# EAGLE design stlink_v3_CAN_shield (EAGLE 9.5.2)
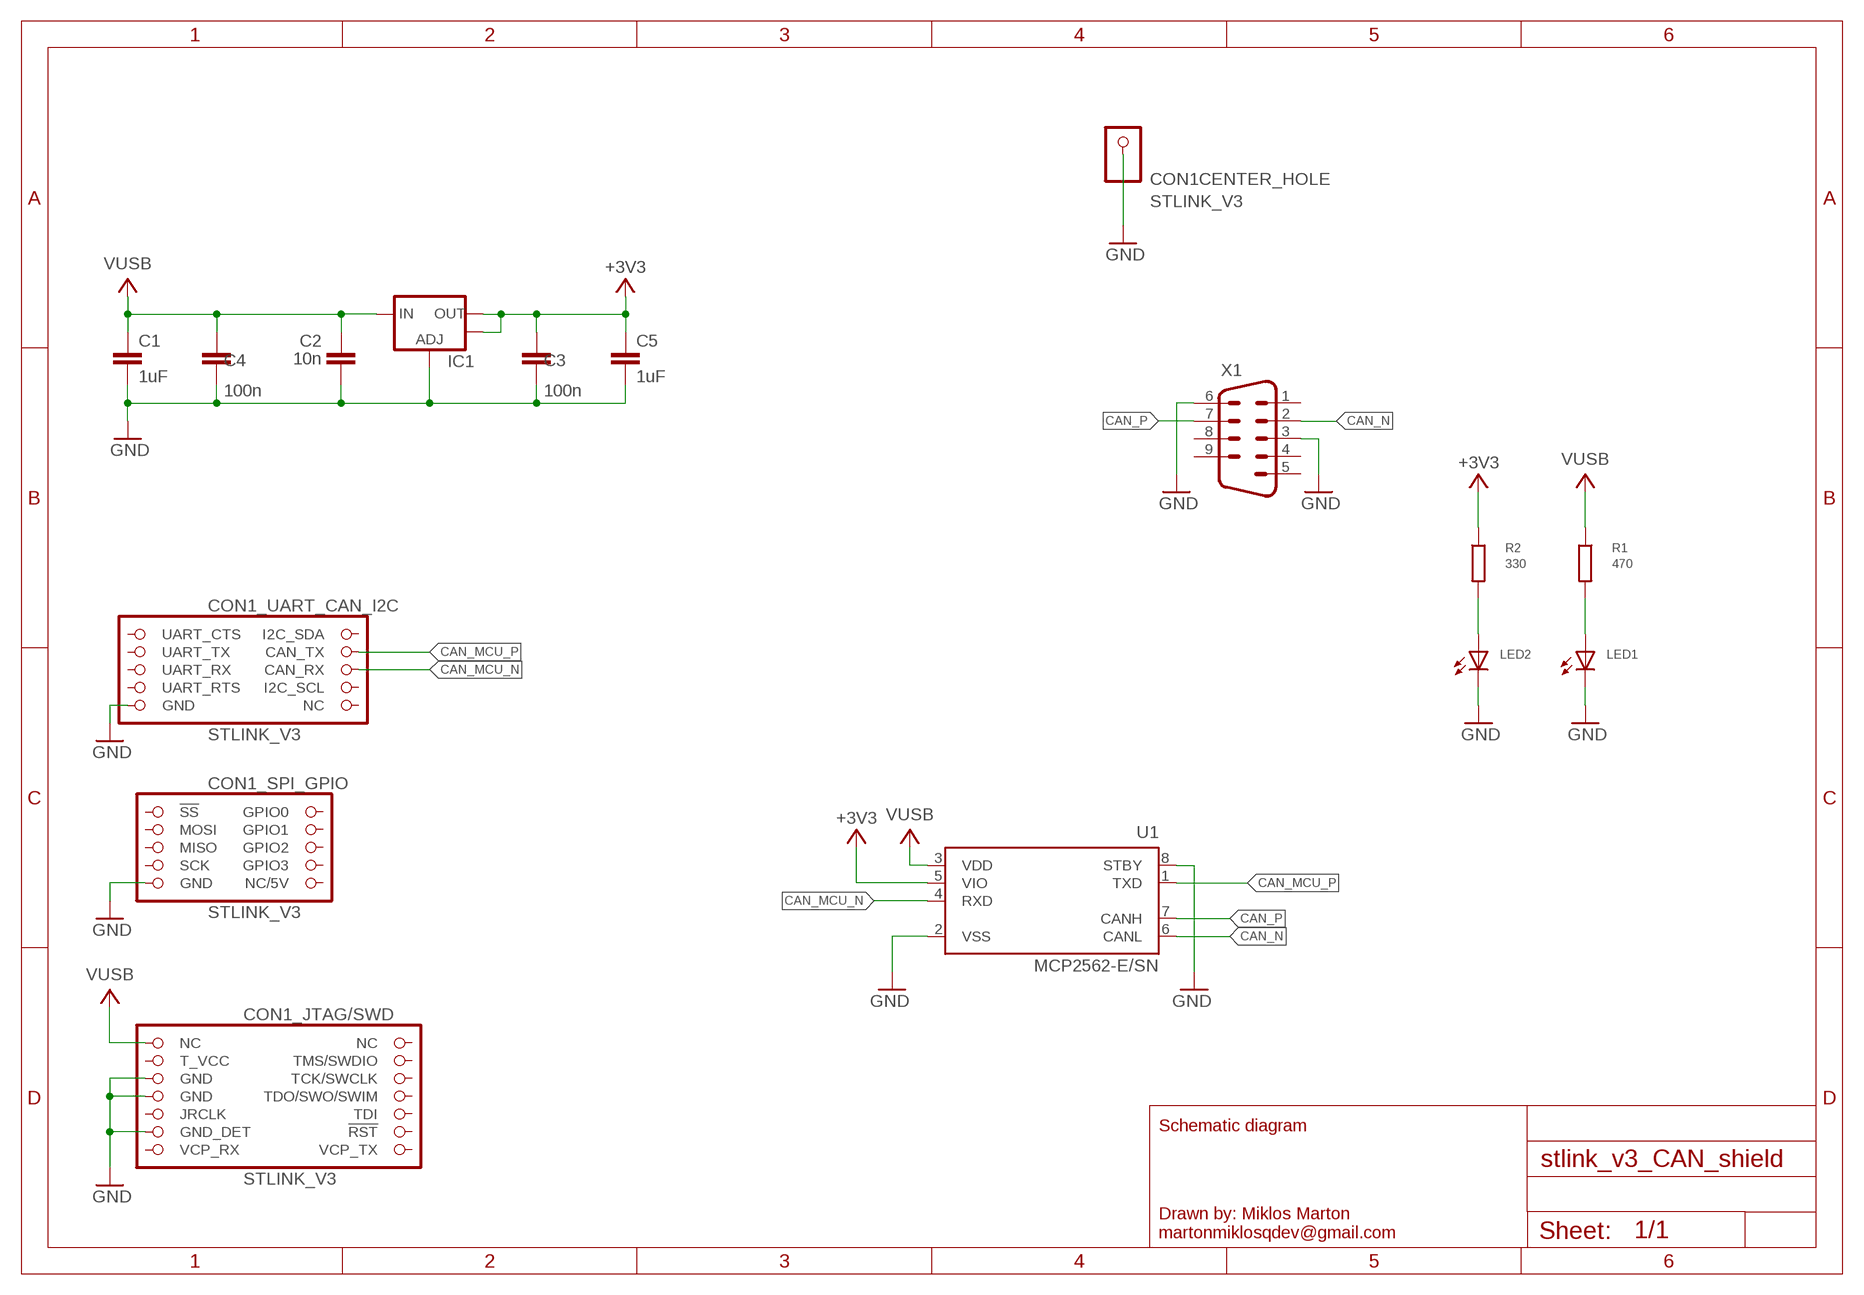
[diagram p0: schematic, sheet 1]

## Parts
C1  1uF  C-EUC0603  [C0603]
C2  10n  C-EUC0603  [C0603]
C3  100n  C-EUC0603  [C0603]
C4  100n  C-EUC0603  [C0603]
C5  1uF  C-EUC0603  [C0603]
CON1  STLINK_V3  STLINK_V3_HATNO_CONTOUR  [STLINKV3_HAT_NO_CONTOUR]
IC1  V_REG_LM1117SOT223  [SOT223]
LED1  LED-0603  [LED-603]
LED2  LED-0603  [LED-603]
R1  470  R-EU_R0603  [R0603]
R2  330  R-EU_R0603  [R0603]
U1  MCP2562-E/SN  [SOIC127P600X175-8N]
X1  M09H  [M09H]

## Nets
+3V3: C3.2 C5.1 IC1.2(OUT) IC1.4(OUT) R2.1 U1.5(VIO)
CAN_MCU_N: CON1.UART_6(_UART_CAN_I2C:CAN_RX) U1.4(RXD)
CAN_MCU_P: CON1.UART_4(_UART_CAN_I2C:CAN_TX) U1.1(TXD)
CAN_N: U1.6(CANL) X1.2
CAN_P: U1.7(CANH) X1.7
GND: C1.2 C2.2 C3.1 C4.1 C5.2 CON1.CENTER CON1.SPI_9(_SPI_GPIO:GND) CON1.STDC_14_5(_JTAG/SWD:GND) CON1.STDC_14_7(_JTAG/SWD:GND) CON1.STDC_14_11(_JTAG/SWD:GND_DET) CON1.UART_9(_UART_CAN_I2C:GND) IC1.1(ADJ) LED1.C LED2.C U1.2(VSS) U1.8(STBY) X1.3 X1.6
VIN_LED_R1: LED2.A R2.2
VIN_LED_R2: LED1.A R1.2
VUSB: C1.1 C2.1 C4.2 CON1.STDC_14_1(_JTAG/SWD:NC) IC1.3(IN) R1.1 U1.3(VDD)
Unconnected: CON1.SPI_1(_SPI_GPIO:!SS) CON1.SPI_2(_SPI_GPIO:GPIO0) CON1.SPI_3(_SPI_GPIO:MOSI) CON1.SPI_4(_SPI_GPIO:GPIO1) CON1.SPI_5(_SPI_GPIO:MISO) CON1.SPI_6(_SPI_GPIO:GPIO2) CON1.SPI_7(_SPI_GPIO:SCK) CON1.SPI_8(_SPI_GPIO:GPIO3) CON1.SPI_10(_SPI_GPIO:NC/5V) CON1.STDC_14_2(_JTAG/SWD:NC) CON1.STDC_14_3(_JTAG/SWD:T_VCC) CON1.STDC_14_4(_JTAG/SWD:TMS/SWDIO) CON1.STDC_14_6(_JTAG/SWD:TCK/SWCLK) CON1.STDC_14_8(_JTAG/SWD:TDO/SWO/SWIM) CON1.STDC_14_9(_JTAG/SWD:JRCLK) CON1.STDC_14_10(_JTAG/SWD:TDI) CON1.STDC_14_12(_JTAG/SWD:!RST) CON1.STDC_14_13(_JTAG/SWD:VCP_RX) CON1.STDC_14_14(_JTAG/SWD:VCP_TX) CON1.UART_1(_UART_CAN_I2C:UART_CTS) CON1.UART_2(_UART_CAN_I2C:I2C_SDA) CON1.UART_3(_UART_CAN_I2C:UART_TX) CON1.UART_5(_UART_CAN_I2C:UART_RX) CON1.UART_7(_UART_CAN_I2C:UART_RTS) CON1.UART_8(_UART_CAN_I2C:I2C_SCL) CON1.UART_10(_UART_CAN_I2C:NC) X1.1 X1.4 X1.5 X1.8 X1.9

## Library data of the parts
C1 C5 = rcl:C-EU: CAPACITOR, European symbol; OC_FARNELL: 2310567; OC_LOMEX: 82-07-86; OC_TME: CL10B105KO8NNNC
C2 = rcl:C-EU: CAPACITOR, European symbol; OC_FARNELL: 2310601; OC_LOMEX: 82-08-73; OC_TME: C0603C103K1RAC
C3 C4 = rcl:C-EU: CAPACITOR, European symbol; OC_FARNELL: 2310560; OC_LOMEX: 82-06-23; OC_TME: CL10B104KB8NNNC
CON1 = stlinkv3:STLINK_V3_HAT
IC1 = SparkFun:V_REG_LM1117: Voltage Regulator LM1117 Standard adjustable voltage regulator but in SMD form. Spark Fun Electronics SKU : COM-00595
LED1 LED2 = dp_devices:LED: Light Emitting Diode
R1 R2 = rcl:R-EU_: RESISTOR, European symbol; OC_TME: 0603SAF1001T5E
U1 = MCP2562-E_SN:MCP2562-E/SN: MCP2562 Series 5 V Surface Mount High-Speed CAN Transceiver - SOIC-8; AVAILABILITY: Unavailable; DESCRIPTION: 1/1 Transceiver Half CANbus 8-SOIC; MF: Microchip; MP: MCP2562-E/SN; PACKAGE: SO-8 Microchip; PRICE: None
X1 = con-subd:M09: SUB-D; OC_FARNELL: unknown; OC_NEWARK: unknown

## Net classes
0 default: width 0.203 mm

## Board
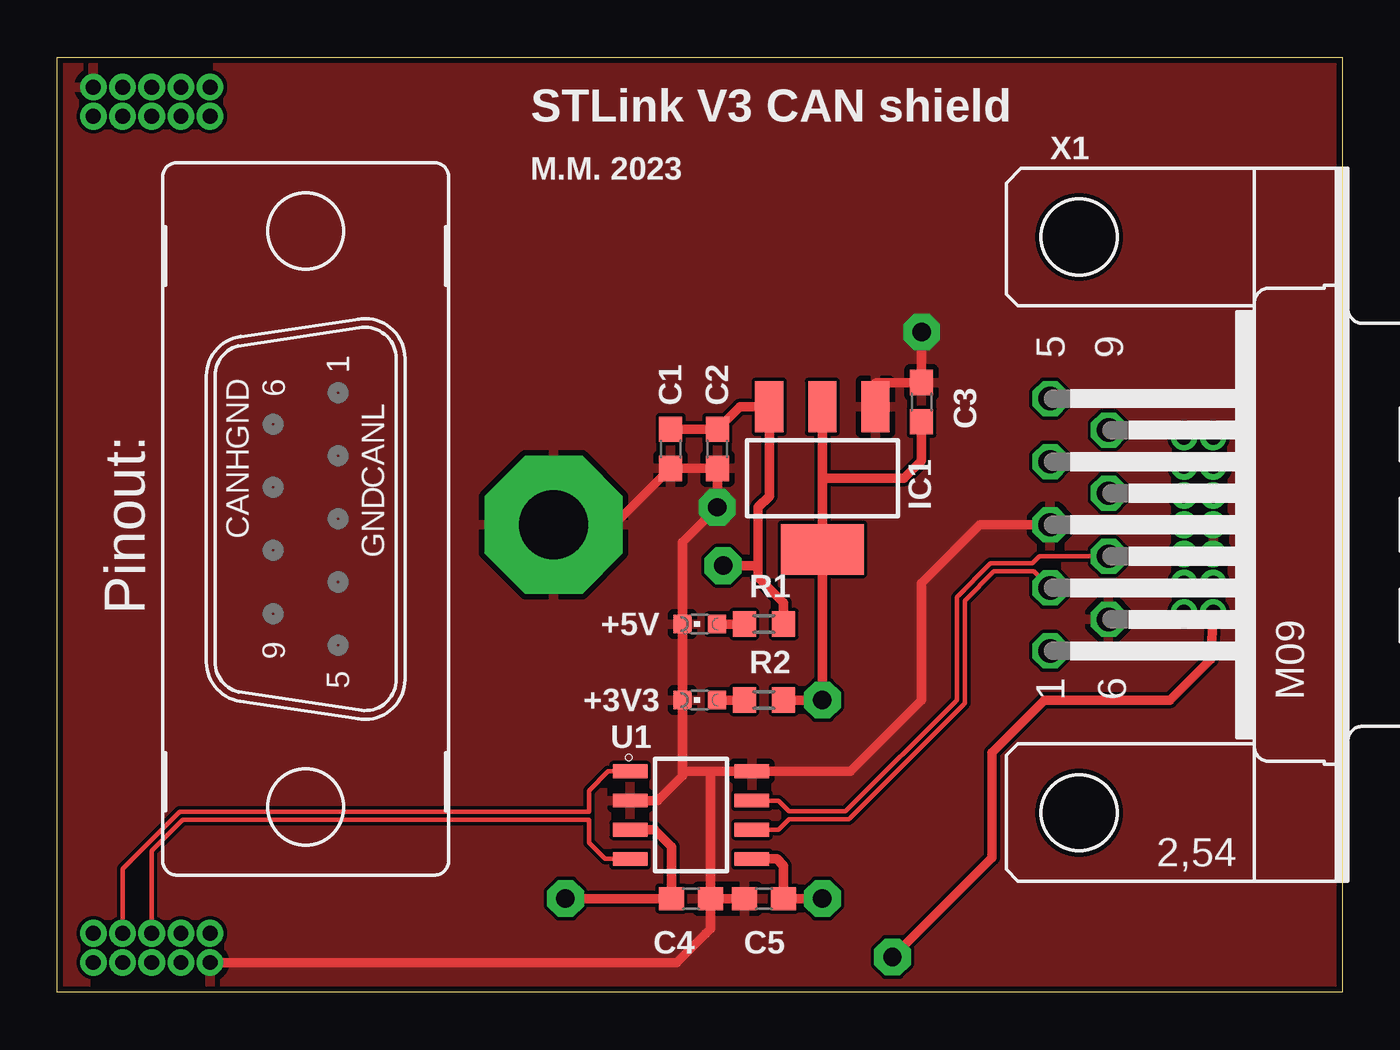
[diagram p1: board, top side]
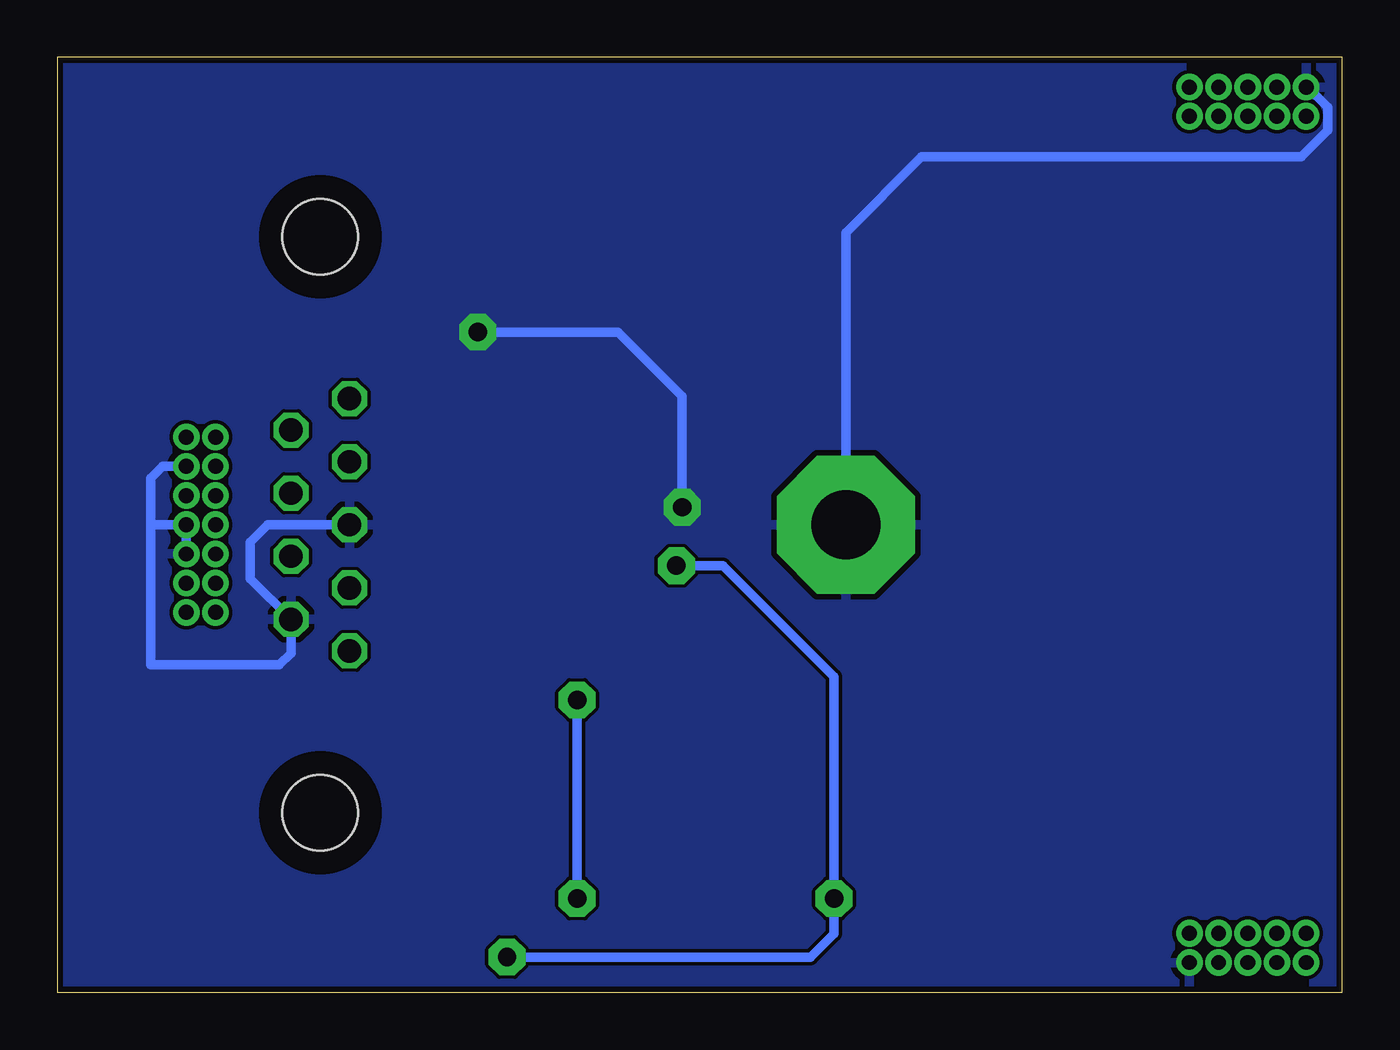
[diagram p2: board, bottom side, seen from below]

Size 55.88 x 40.64 mm. Coordinates in mm from the lower left corner, seen from the top.
Outline: 0,40.64 55.88,40.64 55.88,0 0,0 0,40.64
Copper layers (1*16): Top 0.035mm / dielectric 1.5mm / Bottom 0.035mm
Design rules "dirt_cheap_dirty_boards.v1": minimum track width 5mil, minimum drill 0.3mm, track to track 6mil, track to pad 6mil, pad to pad 6mil, via to via 6mil, smd to smd 0mil, copper to edge 10mil, drill to drill 10mil, minimum pad ring 10mil, minimum via ring 6mil, stop-mask expansion 2mil, vias tented up to drill 25mil, thermal gap 10mil

### Footprints (pad centres in the part's own frame; a part is rotated, then mirrored left to right if it is on the bottom)
C0603 = smd 1.1 x 1: 1 -0.85,0; 2 0.85,0
STLINKV3_HAT_NO_CONTOUR = drill 3 pad 6 octagon: CENTER 0,0 | drill 0.65: SPI_1 14.95,-19.035; SPI_2 14.95,-17.765; SPI_3 16.22,-19.035; SPI_4 16.22,-17.765; SPI_5 17.49,-19.035; SPI_6 17.49,-17.765; SPI_7 18.76,-19.035; SPI_8 18.76,-17.765; SPI_9 20.03,-19.035; SPI_10 20.03,-17.765; STDC_14_1 -28.685,3.81; STDC_14_2 -27.415,3.81; STDC_14_3 -28.685,2.54; STDC_14_4 -27.415,2.54; STDC_14_5 -28.685,1.27; STDC_14_6 -27.415,1.27; STDC_14_7 -28.685,0; STDC_14_8 -27.415,0; STDC_14_9 -28.685,-1.27; STDC_14_10 -27.415,-1.27; STDC_14_11 -28.685,-2.54; STDC_14_12 -27.415,-2.54; STDC_14_13 -28.685,-3.81; STDC_14_14 -27.415,-3.81; UART_1 20.03,19.035; UART_2 20.03,17.765; UART_3 18.76,19.035; UART_4 18.76,17.765; UART_5 17.49,19.035; UART_6 17.49,17.765; UART_7 16.22,19.035; UART_8 16.22,17.765; UART_9 14.95,19.035; UART_10 14.95,17.765
SOT223 = smd 1.219 x 2.235: 1 -2.311,-3.099; 2 0,-3.099; 3 2.311,-3.099 | smd 3.6 x 2.2: 4 0,3.099
LED-603 = smd 0.8 x 0.8: A 0,-0.75; C 0,0.75
R0603 = smd 1 x 1.1: 1 -0.85,0; 2 0.85,0
SOIC127P600X175-8N = smd 1.5 x 0.6: 1 -2.65,1.905; 2 -2.65,0.635; 3 -2.65,-0.635; 4 -2.65,-1.905; 5 2.65,-1.905; 6 2.65,-0.635; 7 2.65,0.635; 8 2.65,1.905
M09H = drill 1.016 octagon: 1 -5.486,1.27; 2 -2.743,1.27; 3 0,1.27; 4 2.743,1.27; 5 5.486,1.27; 6 -4.115,-1.27; 7 -1.372,-1.27; 8 1.372,-1.27; 9 4.115,-1.27 | hole 3.302: 12.522,0; -12.522,0

### Placement (x,y rotation side)
C1  26.67,23.62 270 top
C2  28.7,23.62 270 top
C3  37.59,25.65 270 top
C4  27.56,4.06 180 top
C5  30.73,4.06 180 top
CON1  21.59,20.32 180 top
IC1  33.27,22.35 180 top
LED1  27.94,16 90 top
LED2  27.94,12.7 90 top
R1  30.73,16 180 top
R2  30.73,12.7 180 top
U1  27.56,7.69 0 top
X1  44.45,20.32 90 top

### Tracks (layer width: path | path; a pad name or v marks a point on that pad's centre or on a via)
+3V3  (via drill 0.8 pad 1.6)
  Top 0.406: U1.5 31.3,5.79 31.58,5.5 C5.1 v33.27,4.06 | 33.27,22.35 IC1.4 33.27,13.72 v33.27,12.7 R2.1 | 33.27,22.35 IC1.2 | C3.2 37.59,23.11 36.83,22.35 33.27,22.35
  Bottom 0.406: v33.27,4.06 v33.27,12.7
CAN_MCU_N
  Top 0.203: U1.4 23.82,5.79 23.11,6.5 23.11,7.49 5.46,7.49 4.1,6.14 CON1.UART_6
CAN_MCU_P
  Top 0.203: U1.1 23.95,9.6 23.11,8.76 23.11,7.85 10.16,7.85 | 9.56,7.85 10.16,7.85 | CON1.UART_4 2.83,5.37 5.31,7.85 10.16,7.85
CAN_N
  Top 0.203: U1.6 31.36,7.06 31.82,7.52 34.43,7.52 39.47,12.55 39.47,17.02 40.74,18.29 42.47,18.29 X1.2
CAN_P
  Top 0.203: U1.7 31.36,8.33 31.82,7.87 34.29,7.87 39.12,12.7 39.12,17.16 40.59,18.64 42.42,18.64 42.72,18.95 X1.7
GND  (via drill 0.8 pad 1.6)
  Top 0.406: 27.19,9.6 29.21,9.6 | 29.21,9.6 U1.8 34.49,9.6 37.59,12.7 37.59,17.78 40.13,20.32 X1.3 | U1.2 26.11,8.33 27.19,9.41 27.19,9.6 | C4.1 28.41,9.6 29.21,9.6 | C5.2 C4.1 | v37.59,28.7 C3.1 37.34,26.5 35.62,26.5 35.59,26.47 IC1.1 | LED2.C LED1.C 27.19,19.57 v28.7,21.08 C2.2 C1.2 24.22,20.32 CON1.CENTER | LED2.C 27.18,12.69 | CON1.UART_9 21.35,1.28 26.94,1.28 28.19,2.54 28.41,2.75 C4.1 | LED2.C 27.19,9.6
  Bottom 0.406: CON1.STDC_14_5 CON1.STDC_14_7 51.82,20.32 | v28.7,21.08 28.7,25.91 31.5,28.7 v37.59,28.7 | X1.6 45.77,16.26 | CON1.STDC_14_11 51.31,22.86 51.82,22.35 51.82,20.83 51.82,20.32 | X1.6 45.72,14.73 46.23,14.22 51.82,14.22 51.82,20.32 | X1.6 47.5,17.98 47.5,19.56 46.74,20.32 X1.3 | CON1.CENTER 21.59,33.02 18.29,36.32 1.78,36.32 0.62,37.48 0.62,38.47 1.17,39.02 1.23,39.02 CON1.SPI_9
  pour Bottom: 55.88,0 0,0 0,40.64 55.88,40.64
  pour Top: 55.88,0 0,0 0,40.64 55.88,40.64
VIN_LED_R1
  Top 0.406: R2.2 LED2.A
VIN_LED_R2
  Top 0.406: R1.2 LED1.A
VUSB  (via drill 0.8 pad 1.6)
  Top 0.406: U1.3 25.96,7.06 26.71,6.31 C4.2 v22.1,4.06 | C1.1 C2.1 29.68,25.45 IC1.3 30.96,21.57 30.48,21.08 30.48,18.54 | 30.48,18.54 30.48,18.03 31.58,16.93 R1.1 | CON1.STDC_14_1 50.17,14.48 48.4,12.7 42.93,12.7 40.64,10.41 40.64,5.84 v36.32,1.52 | v28.96,18.54 30.48,18.54
  Bottom 0.406: v36.32,1.52 23.11,1.52 22.1,2.54 v22.1,4.06 22.1,13.72 26.92,18.54 v28.96,18.54

### Text on the board
tPlace: STLink V3 CAN shield | M.M. 2023 | 1 | 6 | GND | CANL | CANH | Pinout: | GND | 9 | 5
tNames: +5V | +3V3